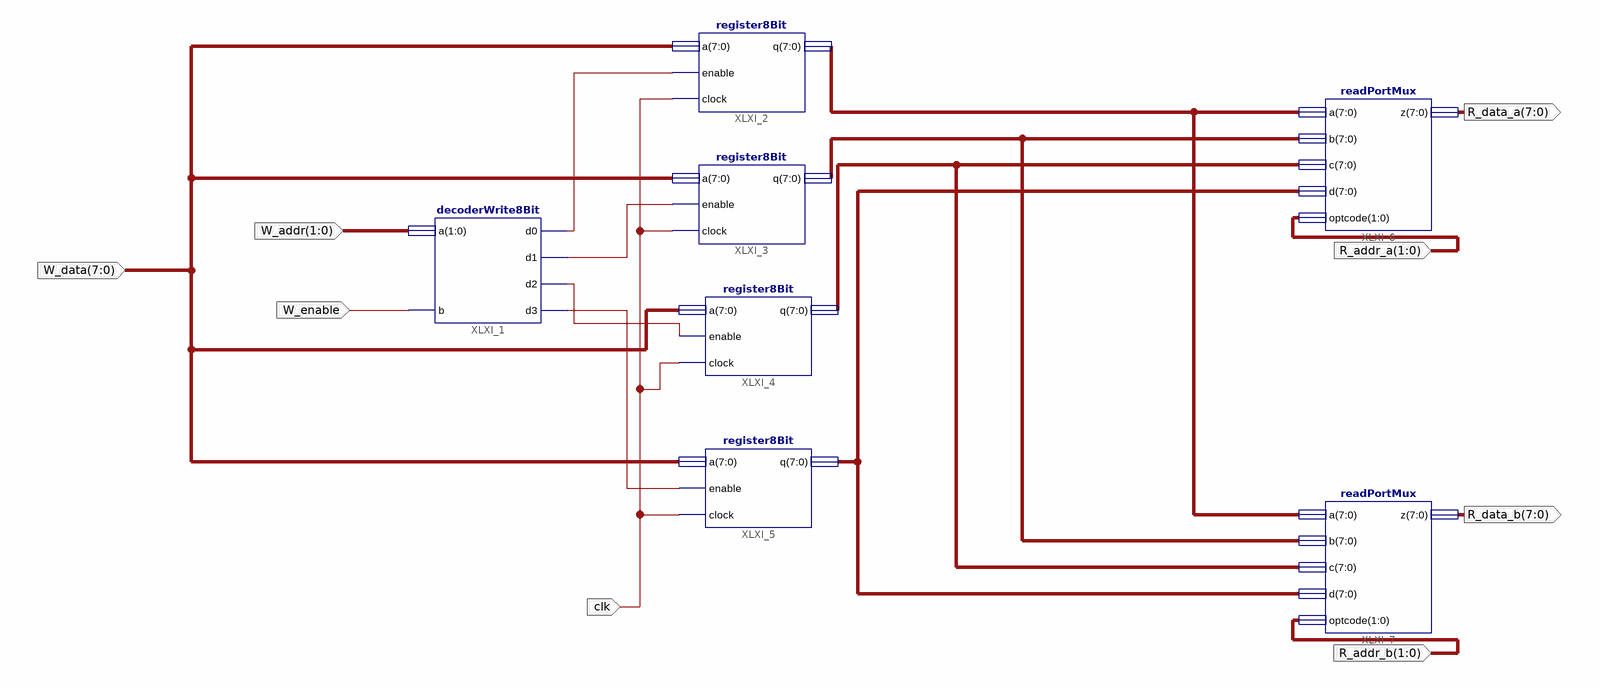
[diagram p0: schematic sheet 1]
// Xilinx ISE schematic RegFile.sch (spartan6) as structural Verilog: 7 symbols, 8 ports
module RegFile (
  input  clk,
  input  W_enable,
  input  [1:0] W_addr,
  input  [7:0] W_data,
  input  [1:0] R_addr_a,
  input  [1:0] R_addr_b,
  output [7:0] R_data_a,
  output [7:0] R_data_b
);

  wire XLXN_25, XLXN_26, XLXN_27, XLXN_28;
  wire [7:0] XLXN_61, XLXN_62, XLXN_64, XLXN_65;

  register8Bit XLXI_2 (.a(W_data), .enable(XLXN_25), .clock(clk), .q(XLXN_61));
  register8Bit XLXI_3 (.a(W_data), .enable(XLXN_26), .clock(clk), .q(XLXN_62));
  register8Bit XLXI_4 (.a(W_data), .enable(XLXN_27), .clock(clk), .q(XLXN_65));
  register8Bit XLXI_5 (.a(W_data), .enable(XLXN_28), .clock(clk), .q(XLXN_64));
  decoderWrite8Bit XLXI_1 (.a(W_addr), .b(W_enable), .d0(XLXN_25), .d1(XLXN_26), .d2(XLXN_27), .d3(XLXN_28));
  readPortMux XLXI_6 (.a(XLXN_61), .b(XLXN_62), .c(XLXN_65), .d(XLXN_64), .optcode(R_addr_a), .z(R_data_a));
  readPortMux XLXI_7 (.a(XLXN_61), .b(XLXN_62), .c(XLXN_65), .d(XLXN_64), .optcode(R_addr_b), .z(R_data_b));
endmodule
